# EAGLE design PCB (EAGLE 8.4.1)

## Sheet 1 of 2
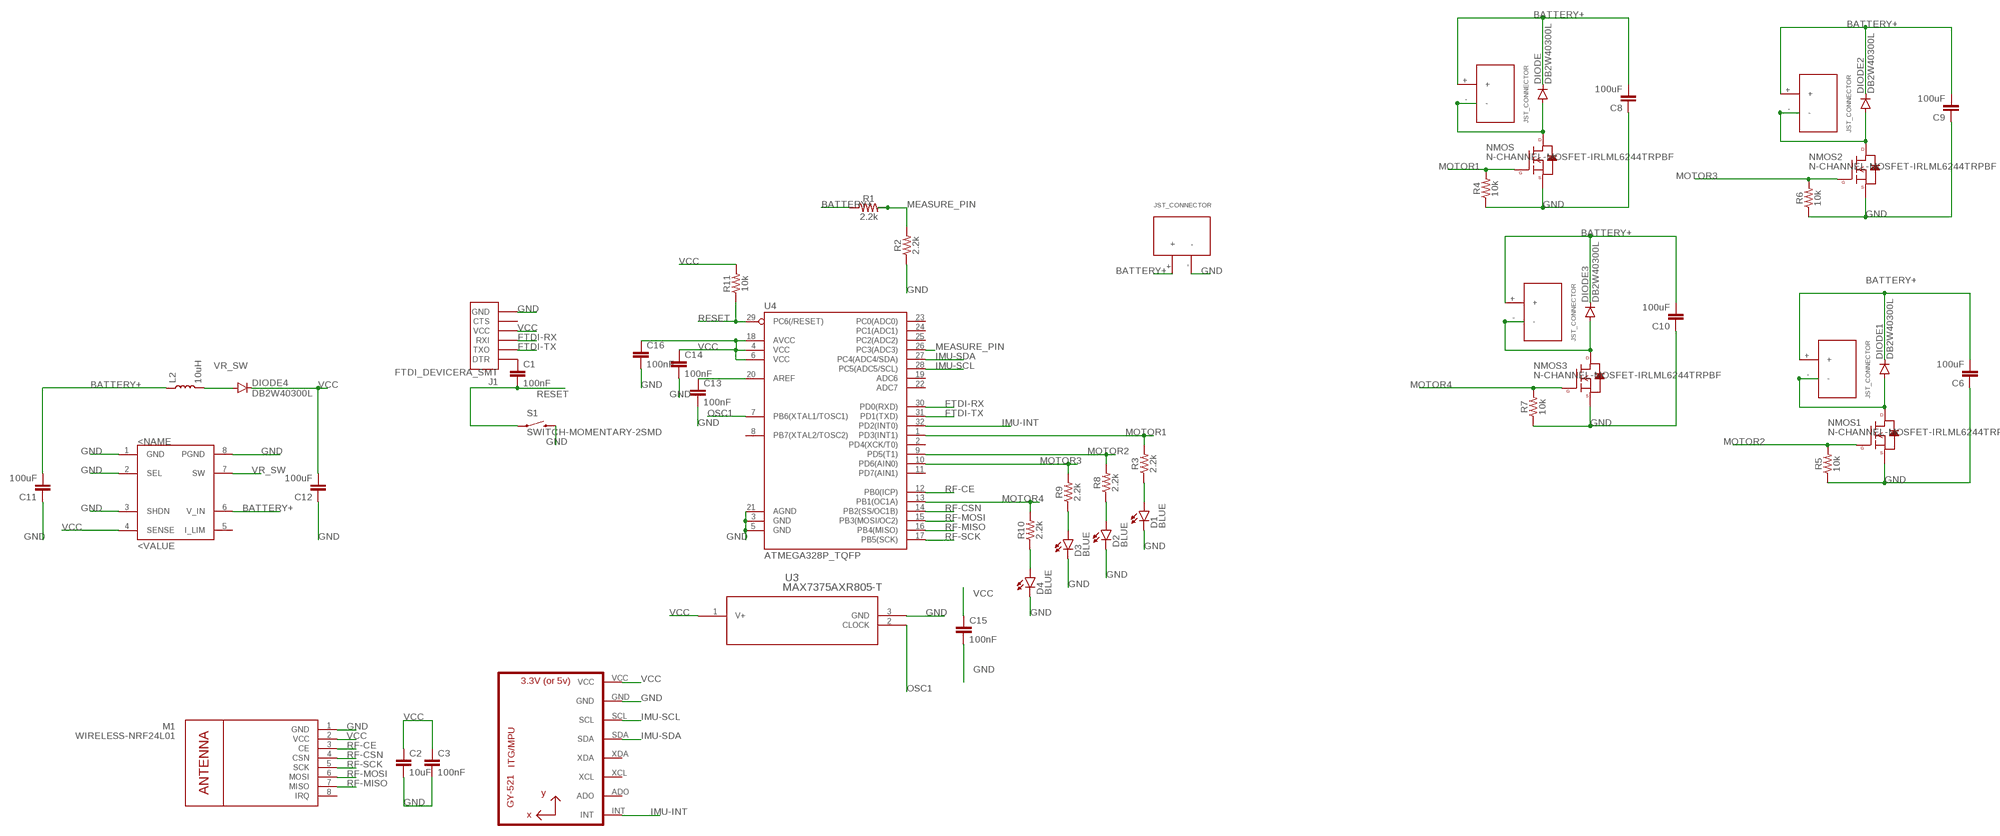
[diagram p0: schematic, sheet 1]

### Parts
BAT  JST_CONNECTOR_FEMALE  [JST_CONNECTOR_FEMALE]
C1  100nF  0.1UF-25V(+80/-20%)(0603)  [0603-CAP]
C2  10uF  CAP0603-CAP  [0603-CAP]
C3  100nF  CAP0603-CAP  [0603-CAP]
C6  100uF  CAP1206  [1206]
C8  100uF  CAP1206  [1206]
C9  100uF  CAP1206  [1206]
C10  100uF  CAP1206  [1206]
C11  100uF  CAP1206  [1206]
C12  100uF  CAP1206  [1206]
C13  100nF  CAP0603-CAP  [0603-CAP]
C14  100nF  CAP0603-CAP  [0603-CAP]
C15  100nF  0.1UF-25V(+80/-20%)(0603)  [0603-CAP]
C16  100nF  CAP0603-CAP  [0603-CAP]
D1  BLUE  LED-BLUE0603  [LED-0603]
D2  BLUE  LED-BLUE0603  [LED-0603]
D3  BLUE  LED-BLUE0603  [LED-0603]
D4  BLUE  LED-BLUE0603  [LED-0603]
DIODE  DB2W40300L  [MINI2-F3-B]
DIODE1  DB2W40300L  [MINI2-F3-B]
DIODE2  DB2W40300L  [MINI2-F3-B]
DIODE3  DB2W40300L  [MINI2-F3-B]
DIODE4  DB2W40300L  [MINI2-F3-B]
J1  FTDI_DEVICERA_SMT  [FTDI_DEVICE_RA_SMT]
L2  10uH  INDUCTOR-0603-33NH  [0603]
M1  WIRELESS-NRF24L01  [WIRELESS-NRF24L01]
MOTOR  JST_CONNECTOR_FEMALE  [JST_CONNECTOR_FEMALE]
MOTOR1  JST_CONNECTOR_FEMALE  [JST_CONNECTOR_FEMALE]
MOTOR2  JST_CONNECTOR_FEMALE  [JST_CONNECTOR_FEMALE]
MOTOR3  JST_CONNECTOR_FEMALE  [JST_CONNECTOR_FEMALE]
NMOS  N-CHANNEL-MOSFET-IRLML6244TRPBF  [SOT23-3]
NMOS1  N-CHANNEL-MOSFET-IRLML6244TRPBF  [SOT23-3]
NMOS2  N-CHANNEL-MOSFET-IRLML6244TRPBF  [SOT23-3]
NMOS3  N-CHANNEL-MOSFET-IRLML6244TRPBF  [SOT23-3]
R1  2.2k  2.2KOHM-0603-1/10W-1%  [0603]
R2  2.2k  2.2KOHM-0603-1/10W-1%  [0603]
R3  2.2k  2.2KOHM-0603-1/10W-1%  [0603]
R4  10k  2.2KOHM-0603-1/10W-1%  [0603]
R5  10k  2.2KOHM-0603-1/10W-1%  [0603]
R6  10k  2.2KOHM-0603-1/10W-1%  [0603]
R7  10k  2.2KOHM-0603-1/10W-1%  [0603]
R8  2.2k  2.2KOHM-0603-1/10W-1%  [0603]
R9  2.2k  2.2KOHM-0603-1/10W-1%  [0603]
R10  2.2k  2.2KOHM-0603-1/10W-1%  [0603]
R11  10k  2.2KOHM-0603-1/10W-1%  [0603]
S1  SWITCH-MOMENTARY-2SMD  [TACTILE-SWITCH-SMD]
U2  GY-521MPU6050  [GY-521]
U3  MAX7375AXR805-T  [21-0075D]
U4  ATMEGA328P_TQFP  [TQFP32-08]
U$4  LT1300CS8#PBF-NDLT1300CS8#PBF-ND  [SOIC-8_S]

### Nets
BATTERY+: BAT.+ C6.2 C8.2 C9.2 C10.2 C11.2 DIODE1.NEG(GPIN) DIODE2.NEG(GPIN) DIODE3.NEG(GPIN) DIODE.NEG(GPIN) L2.1 MOTOR1.+ MOTOR2.+ MOTOR3.+ MOTOR.+ R1.1 U$4.6(V_IN)
FTDI-RX: J1.3(RXI) U4.30(PD0(RXD))
FTDI-TX: J1.2(TXO) U4.31(PD1(TXD))
GND: BAT.- C2.2 C3.2 C6.1 C8.1 C9.1 C10.1 C11.1 C12.1 C13.2 C14.2 C15.2 C16.2 D1.C D2.C D3.C D4.C J1.6(GND) M1.1(GND) NMOS1.2(S) NMOS2.2(S) NMOS3.2(S) NMOS.2(S) R2.1 R4.1 R5.1 R6.1 R7.1 S1.3 U2.GND U3.3(GND) U4.3(GND) U4.5(GND) U4.21(AGND) U$4.1(GND) U$4.2(SEL) U$4.3(SHDN) U$4.8(PGND)
IMU-INT: U2.INT U4.32(PD2(INT0))
IMU-SCL: U2.SCL U4.28(PC5(ADC5/SCL))
IMU-SDA: U2.SDA U4.27(PC4(ADC4/SDA))
MEASURE_PIN: R1.2 R2.2 U4.26(PC3(ADC3))
MOTOR1: NMOS.1(G) R3.2 R4.2 U4.1(PD3(INT1))
MOTOR2: NMOS1.1(G) R5.2 R8.2 U4.9(PD5(T1))
MOTOR3: NMOS2.1(G) R6.2 R9.2 U4.10(PD6(AIN0))
MOTOR4: NMOS3.1(G) R7.2 R10.2 U4.13(PB1(OC1A))
N$1: D4.A R10.1
N$3: D3.A R9.1
N$4: DIODE1.POS(PPIN) MOTOR1.- NMOS1.3(D)
N$5: DIODE2.POS(PPIN) MOTOR2.- NMOS2.3(D)
N$6: DIODE.POS(PPIN) MOTOR.- NMOS.3(D)
N$7: DIODE3.POS(PPIN) MOTOR3.- NMOS3.3(D)
N$10: D2.A R8.1
N$11: D1.A R3.1
N$13: C1.1 J1.1(DTR)
N$15: C13.1 U4.20(AREF)
OSC1: U3.2(CLOCK) U4.7(PB6(XTAL1/TOSC1))
RESET: C1.2 R11.1 S1.1 U4.29(PC6(/RESET))
RF-CE: M1.3(CE) U4.12(PB0(ICP))
RF-CSN: M1.4(CSN) U4.14(PB2(SS/OC1B))
RF-MISO: M1.7(MISO) U4.16(PB4(MISO))
RF-MOSI: M1.6(MOSI) U4.15(PB3(MOSI/OC2))
RF-SCK: M1.5(SCK) U4.17(PB5(SCK))
VCC: C2.1 C3.1 C12.2 C14.1 C15.1 C16.1 DIODE4.NEG(GPIN) J1.4(VCC) M1.2(VCC) R11.2 U2.VCC U3.1(V+) U4.4(VCC) U4.6(VCC) U4.18(AVCC) U$4.4(SENSE)
VR_SW: DIODE4.POS(PPIN) L2.2 U$4.7(SW)
Unconnected: J1.5(CTS) M1.8(IRQ) U2.ADO U2.XCL U2.XDA U4.2(PD4(XCK/T0)) U4.8(PB7(XTAL2/TOSC2)) U4.11(PD7(AIN1)) U4.19(ADC6) U4.22(ADC7) U4.23(PC0(ADC0)) U4.24(PC1(ADC1)) U4.25(PC2(ADC2)) U$4.5(I_LIM)

## Sheet 2 of 2

## Library data of the parts
BAT MOTOR MOTOR1-MOTOR3 = quad:JST_CONNECTOR_FEMALE
C1 C15 = SparkFun-Capacitors:0.1UF-25V(+80/-20%)(0603): CAP-00810 Ceramic Standard decoupling cap; PROD_ID: CAP-00810; VALUE: 0.1uF
C2 C3 C6 C8-C14 C16 = SparkFun-Passives:CAP: Capacitor Standard 0603 ceramic capacitor, and 0.1" leaded capacitor.
D1 = LEDs:LED-BLUE: Blue LEDs for production use Various blue LEDs stocked by SparkFun production 0603 - DIO-08575 Rebel - DIO-09553 1206 - DIO-09911; PROD_ID: DIO-08575; SPICEPREFIX: D
D2-D4 = LEDs:LED-BLUE: Blue LEDs for production use Various blue LEDs stocked by SparkFun production 0603 - DIO-08575 Rebel - DIO-09553 1206 - DIO-09911; PROD_ID: DIO-08575
DIODE DIODE1-DIODE4 = quad:DB2W40300L
J1 = quad:FTDI_DEVICE: Connector which mates to FTDI basic or FTDI cable.; PROD_ID: CONN-08971
L2 = SparkFun-Coils:INDUCTOR: Inductors Resist changes in electrical current. Basically a coil of wire. SparkFun Products: SparkFun Load Cell Amplifier - HX711 <https://www.sparkfun.com/products/13879> IOIO-OTG - V2.2 <https://www.sparkfun.com/products/13613>; PROD_ID: NDUC-07874; VALUE: 33nH/±5%/500mA
M1 = quad:WIRELESS-NRF24L01: 2.4 GHz Wireless Module based on NRF24L01 chip
NMOS NMOS1-NMOS3 = quad:N-CHANNEL-MOSFET: N-Channel MOSFET Mode Field Effect Transistor; DATASHEET: http://www.mouser.com/ds/2/196/irlml6244pbf-936666.pdf; MOUSER: 942-IRLML6244TRPBF; URL: http://www.mouser.com/Search/ProductDetail.aspx?R=IRLML6244TRPBFvirtualkey57370000virtualkey942-IRLML6244TRPBF
R1 R2 R8-R10 = SparkFun-Resistors:2.2KOHM: 2.2kΩ resistor A resistor is a passive two-terminal electrical component that implements electrical resistance as a circuit element. Resistors act to reduce current flow, and, at the same time, act to lower voltage levels within circuits. - Wikipedia; PROD_ID: RES-08272
R3 = SparkFun-Resistors:2.2KOHM: 2.2kΩ resistor A resistor is a passive two-terminal electrical component that implements electrical resistance as a circuit element. Resistors act to reduce current flow, and, at the same time, act to lower voltage levels within circuits. - Wikipedia; PROD_ID: RES-08272; SPICEPREFIX: R
R4-R7 R11 = SparkFun-Resistors:2.2KOHM: 2.2kΩ resistor A resistor is a passive two-terminal electrical component that implements electrical resistance as a circuit element. Resistors act to reduce current flow, and, at the same time, act to lower voltage levels within circuits. - Wikipedia; PROD_ID: RES-08272; VALUE: 2.2k
S1 = quad:SWITCH-MOMENTARY-2: Various NO switches- pushbuttons, reed, etc; PROD_ID: SWCH-08247
U2 = quad:GY-521
U3 = MAX7375AXR805-T:MAX7375AXR805-T; AVAILABILITY: Good; DESCRIPTION: OSCILLATOR MEMS 8MHZ CMOS SMD; MF: Maxim Integrated; MP: MAX7375AXR805+T; PACKAGE: SC-70 Maxim Integrated; PRICE: 1.06 USD
U4 = quad:ATMEGA328P_TQFP; PROD_ID: IC-09069
U$4 = LT1300:LT1300CS8#PBF-ND

## Board
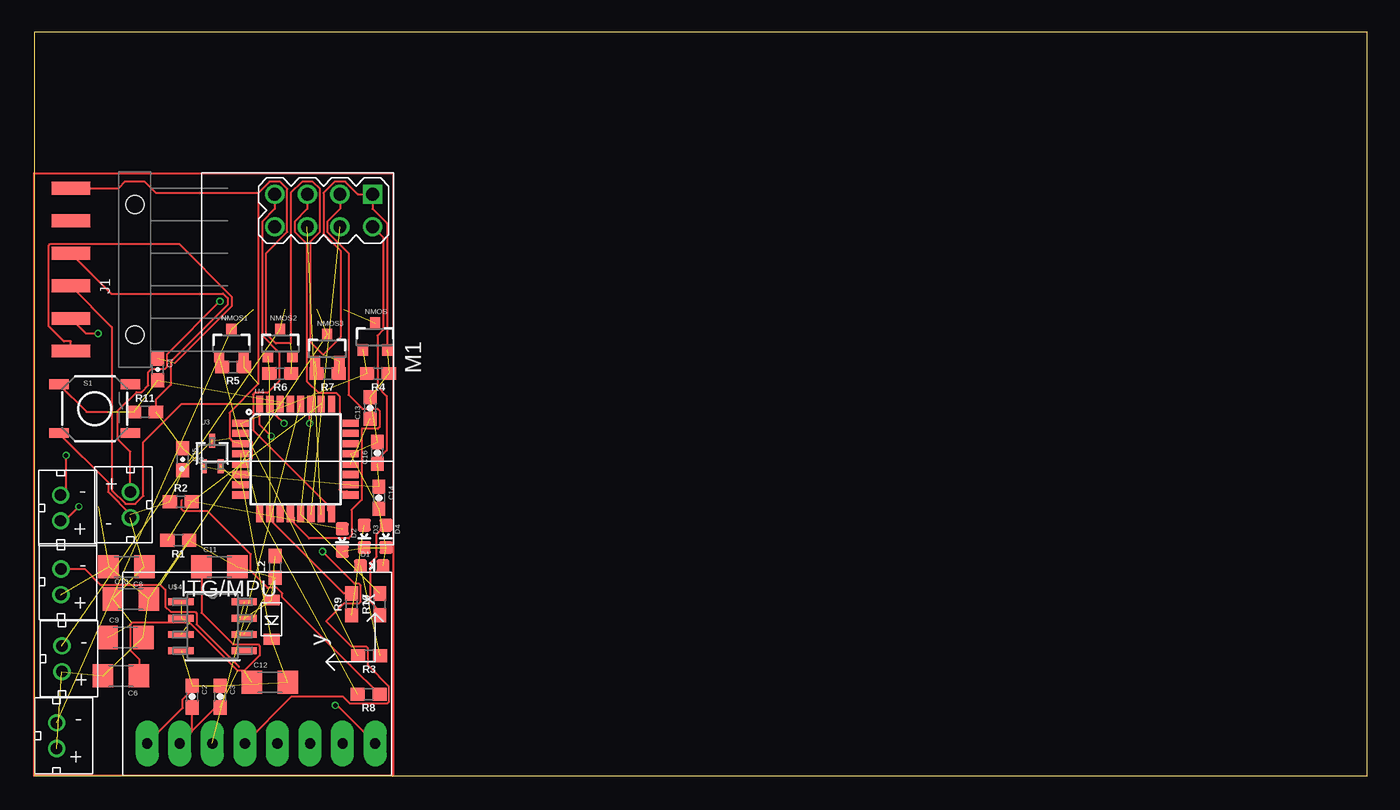
[diagram p1: board, top side]
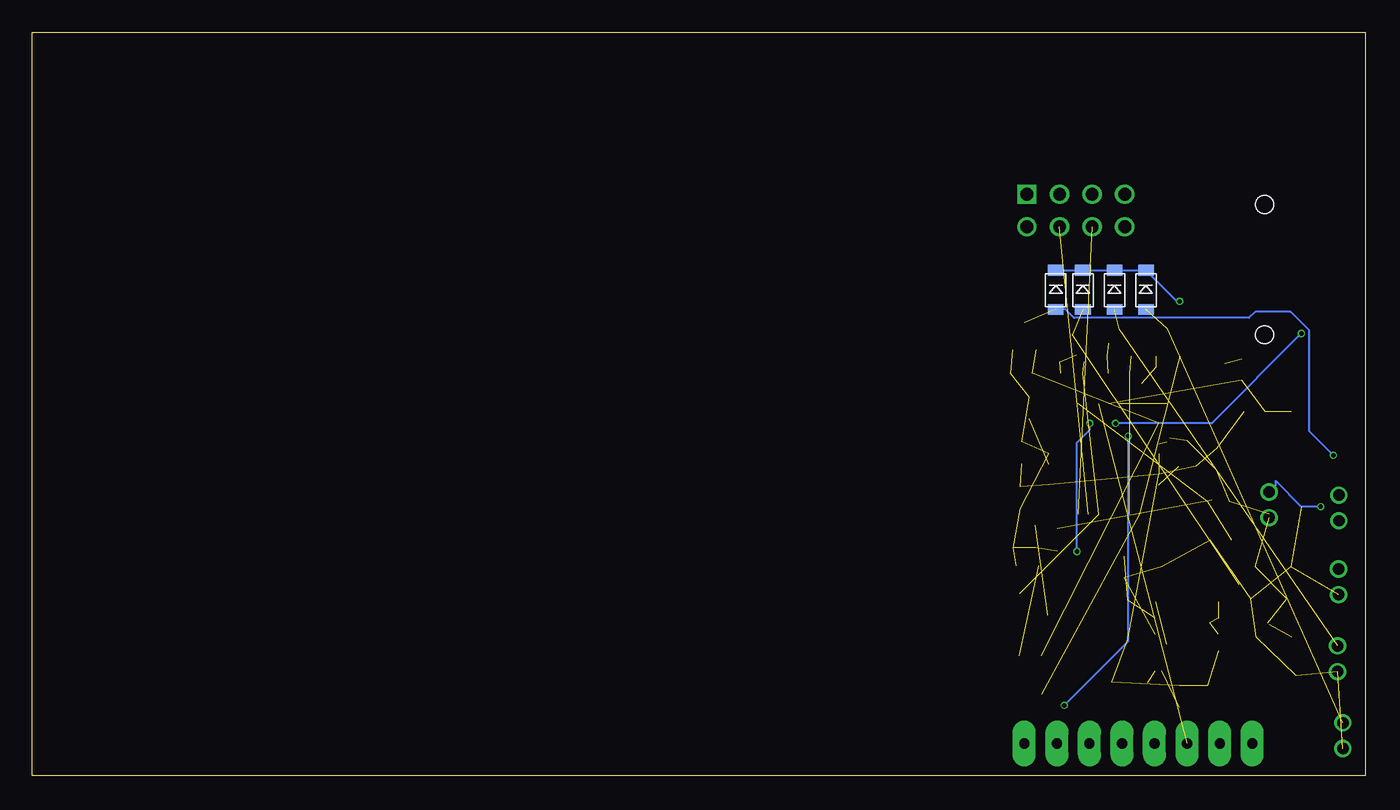
[diagram p2: board, bottom side, seen from below]

Size 104 x 58 mm. Coordinates in mm from the lower left corner, seen from the top.
Outline: 0,0 104,0 104,58 0,58 0,0
Copper layers (1*2*15*16): Top 0.035559375mm / dielectric 0.17018125mm / layer 2 0.01778125mm / dielectric 47mil / layer 15 0.01778125mm / dielectric 0.17018125mm / Bottom 0.035559375mm
Design rules "oshpark-4layer": minimum track width 5mil, minimum drill 10mil, track to track 5mil, track to pad 5mil, pad to pad 5mil, via to via 5mil, smd to smd 5mil, copper to edge 15mil, drill to drill 6mil, minimum pad ring 4mil, minimum via ring 4mil, stop-mask expansion 2.5mil, vias tented up to drill 0mil, thermal gap 10mil

### Footprints (pad centres in the part's own frame; a part is rotated, then mirrored left to right if it is on the bottom)
JST_CONNECTOR_FEMALE = drill 0.889: + 0,1; - 0,-1
0603-CAP = smd 1.1 x 1: 1 -0.85,0; 2 0.85,0
1206 = smd 1.6 x 1.8: 1 -1.4,0; 2 1.4,0
LED-0603 = smd 1 x 1: A 0,-0.877; C 0,0.877
MINI2-F3-B = smd 1.22 x 0.85: NEG 0,1.55; POS 0,-1.5
FTDI_DEVICE_RA_SMT = smd 1 x 3: 1 -6.35,5; 2 -3.81,5; 3 -1.27,5; 4 1.27,5; 5 3.81,5; 6 6.35,5 | hole 1.4: -5.08,0; 5.08,0
0603 = smd 1.1 x 1: 1 -0.85,0; 2 0.85,0
WIRELESS-NRF24L01 = drill 1 square: 1 -12.7,6.35 | drill 1: 2 -10.16,6.35; 3 -12.7,3.81; 4 -10.16,3.81; 5 -12.7,1.27; 6 -10.16,1.27; 7 -12.7,-1.27; 8 -10.16,-1.27
SOT23-3 = smd 0.8 x 0.9: 1 -0.95,-1; 2 0.95,-1; 3 0,1.1
TACTILE-SWITCH-SMD = smd 1.524 x 0.762: 1 -2.794,1.905; 2 2.794,1.905; 3 -2.794,-1.905; 4 2.794,-1.905
GY-521 = drill 0.8 pad 1.778 long: ADO -8.89,-6.35; GND -8.89,6.35; INT -8.89,-8.89; SCL -8.89,3.81; SDA -8.89,1.27; VCC -8.89,8.89; XCL -8.89,-3.81; XDA -8.89,-1.27
21-0075D = smd 0.457 x 1.118: 1 -0.65,-0.991; 2 0.65,-0.991; 3 0,0.991
TQFP32-08 = smd 1.27 x 0.559: 1 -4.293,2.8; 2 -4.293,2; 3 -4.293,1.2; 4 -4.293,0.4; 5 -4.293,-0.4; 6 -4.293,-1.2; 7 -4.293,-2; 8 -4.293,-2.8; 17 4.293,-2.8; 18 4.293,-2; 19 4.293,-1.2; 20 4.293,-0.4; 21 4.293,0.4; 22 4.293,1.2; 23 4.293,2; 24 4.293,2.8 | smd 0.559 x 1.27: 9 -2.8,-4.293; 10 -2,-4.293; 11 -1.2,-4.293; 12 -0.4,-4.293; 13 0.4,-4.293; 14 1.2,-4.293; 15 2,-4.293; 16 2.8,-4.293; 25 2.8,4.293; 26 2,4.293; 27 1.2,4.293; 28 0.4,4.293; 29 -0.4,4.293; 30 -1.2,4.293; 31 -2,4.293; 32 -2.8,4.293
SOIC-8_S = smd 1.981 x 0.533: 1 -2.464,1.905; 2 -2.464,0.635; 3 -2.464,-0.635; 4 -2.464,-1.905; 5 2.464,-1.905; 6 2.464,-0.635; 7 2.464,0.635; 8 2.464,1.905

### Placement (x,y rotation side)
BAT  7.52,21.14 0 top
C1  9.64,31.69 270 top
C2  12.33,6.19 270 top
C3  14.52,6.19 270 top
C6  6.79,7.8 180 top
C8  7.21,16.3 180 top
C9  7.13,10.8 0 top
C10  7.55,13.8 0 top
C11  14.47,16.3 0 top
C12  18.39,7.3 0 top
C13  26.21,28.69 90 top
C14  26.9,21.69 270 top
C15  11.59,24.69 270 top
C16  26.78,25.19 90 top
D1  26.35,16.38 270 top
D2  24.04,18.38 180 top
D3  25.76,18.69 180 top
D4  27.45,18.69 180 top
DIODE  24.16,37.87 0 bottom
DIODE1  17.12,37.87 0 bottom
DIODE2  19.58,37.87 0 bottom
DIODE3  22.04,37.87 0 bottom
DIODE4  18.53,12.22 180 top
J1  7.87,39.48 90 top
L2  18.81,16.3 90 top
M1  20.05,32.66 270 top
MOTOR  2.08,20.9 180 top
MOTOR1  1.76,3.14 180 top
MOTOR2  2.18,9.14 180 top
MOTOR3  2.1,15.14 180 top
NMOS  26.6,34.22 0 top
NMOS1  15.4,33.72 0 top
NMOS2  19.2,33.72 0 top
NMOS3  22.87,33.3 0 top
R1  11.26,18.38 180 top
R2  11.45,21.38 0 top
R3  26.14,9.38 180 top
R4  26.83,31.38 180 top
R5  15.52,31.88 180 top
R6  19.21,31.38 180 top
R7  22.9,31.38 180 top
R8  26.09,6.38 180 top
R9  24.78,13.38 90 top
R10  26.97,13.38 90 top
R11  8.66,28.38 0 top
S1  4.74,28.64 0 top
U2  17.72,11.43 90 top
U3  13.9,25.14 0 top
U4  20.4,24.71 0 top
U$4  13.93,11.67 0 top

### Tracks (layer width: path | path; a pad name or v marks a point on that pad's centre or on a via)
BATTERY+  (via drill 0.35)  (11 unrouted)
  Top 0.152: v14.5,37 10.37,32.87 10.37,31.89 10.23,31.76 9.19,31.76 8.91,31.48 8.91,30.46 8.39,29.93 7.99,29.93 6.54,28.49 6.54,26.26 7.52,25.28 BAT.+ | MOTOR.+ 2.4,19.9 v3.5,21
  Bottom 0.152: v14.5,37 14.7,37 16.85,39.15 | 16.85,39.15 DIODE1.NEG | DIODE1.NEG DIODE2.NEG DIODE3.NEG DIODE.NEG | DIODE1.NEG 16.85,39.15 | v3.5,21 5,21 7,23 7,22.66 BAT.+
FTDI-RX  (1 unrouted)
  Top 0.152: J1.3 6.08,35 6.08,22.27 7.14,21.21 7.9,21.21 8.53,21.83 8.53,26.02 11.51,29 15.5,29
FTDI-TX  (via drill 0.35)
  Top 0.152: J1.2 4.04,34.5 v5,34.5 | v19.5,27.5 18.86,28.14 18.83,28.14 18.4,28.57 U4.31
  Bottom 0.152: v5,34.5 12,27.5 v19.5,27.5
GND  (30 unrouted)
  Top 0.152: U4.5 16.4,24.6 16.84,24.6 16.97,24.74 16.97,26.08 15.5,26.08 15.24,26.34 15.24,28.32 17.49,30.56 17.49,45.46 17.52,45.48 | 17.52,45.48 18.37,46.34 19.19,46.34 19.76,45.77 19.76,42.41 18.1,40.75 18.1,34.47 18.85,33.72 20.03,33.72 20.03,45.46 20.91,46.34 21.73,46.34 22.3,45.77 22.3,42.41 21.58,41.69 21.58,33.82 22.55,32.84 23.91,34.2 23.91,40.95 22.57,42.29 22.57,45.46 23.45,46.34 24.27,46.34 25.25,45.36 M1.1 26.4,44.21 27.53,43.08 27.53,33.24 NMOS.2 | 17.52,45.48 9.48,45.48 8.61,46.35 7.13,46.35 6.61,45.83 J1.6 | S1.3 5.77,22.91 5.77,22.14 7.52,20.4 BAT.- | C2.2 12.33,3.5 U2.GND 14.17,5.34 C3.2 | C6.1 8.19,9.12 7.5,9.8 7.5,11.79 7.63,11.93 12.14,11.93 15.87,8.2 16.41,8.2 17.61,9.4 17.61,10.13 17.48,10.26 15.52,10.26 13.07,12.71 C11.1
IMU-INT  (via drill 0.35)
  Top 0.152: U2.INT 23.65,5.5 v23.5,5.5 | v18.5,26.5 17.6,27.4 U4.32
  Bottom 0.152: v23.5,5.5 18.5,10.5 v18.5,26.5
IMU-SCL  (1 unrouted)
IMU-SDA  (via drill 0.35)
  Top 0.152: 16.5,2 16.45,2.05 U2.SDA 20.11,6.2 24.09,6.2 24.61,5.68 27.57,5.68 27.69,5.8 27.69,6.96 26.04,8.61 26.04,9.96 25.92,10.08 24.79,10.08 22.8,12.08 24.2,13.48 25.36,13.48 25.48,13.6 25.48,14.86 25.36,14.98 25.02,14.98 v22.5,17.5 | v21.5,27.5 21.5,28.9 U4.27
  Bottom 0.152: v22.5,17.5 22.5,26 21.5,27 v21.5,27.5
MEASURE_PIN  (2 unrouted)
MOTOR1  (3 unrouted)
MOTOR2  (3 unrouted)
MOTOR3  (2 unrouted)
  Top 0.152: U4.10 18.69,20.12 18.69,19.69 24.15,14.23 R9.2
MOTOR4  (3 unrouted)
N$1
  Top 0.152: R10.1 26.97,12.86 26.24,13.59 26.24,16.63 26.72,17.11 26.72,18.84 D4.A
N$2  (via drill 0.35)
  other vias: -22,44
N$3  (1 unrouted)
N$4  (2 unrouted)
N$5  (2 unrouted)
N$6  (via drill 0.35)  (1 unrouted)
  Top 0.152: MOTOR.- 2.5,22.32 v2.5,25
  Bottom 0.152: DIODE.POS 23.4,36.37 22.75,35.72 9.09,35.72 8.61,36.19 5.83,36.19 4.39,34.75 4.39,26.89 v2.5,25
N$7  (2 unrouted)
  Top 0.152: MOTOR3.- 3.95,16.14 5.16,14.93 9.85,14.93 10.25,14.53 10.25,13.21 10.66,12.8 12.55,12.8 12.69,12.67 12.69,11.81 16,8.5
N$8
  Top 0.152: 0,47 28,47 28,0 0,0 0,47
N$10  (1 unrouted)
  Top 0.152: R8.1 24.67,8.65 24.64,8.65 19.37,13.93 19.37,14.24 18.94,14.67 18.21,14.67 16.9,15.99 16.9,17.3 13.54,20.65 11.65,20.65 11.52,20.79 11.52,21.5
N$11  (1 unrouted)
N$13  (1 unrouted)
  Top 0.152: 10.98,32.19 15.41,36.62 15.41,37.38 11.31,41.48 1.27,41.48 1.14,41.34 1.14,35.08 2.32,33.89 2.87,33.89 J1.1
N$15  (1 unrouted)
OSC1  (1 unrouted)
RESET  (3 unrouted)
  Top 0.152: S1.1 4.11,28.38 5.77,28.38
RF-CE
  Top 0.152: M1.3 23.86,44.21 22.88,43.23 22.88,42.41 24.53,40.76 24.53,29.7 25.61,28.62 26.8,28.62 26.94,28.48 26.94,27.2 26.8,27.06 25.56,27.06 25.56,21.54 24.77,20.75 24.77,18.75 24.55,18.53 21.45,18.53 20.29,19.69 20.29,20.12 U4.12
RF-CSN  (1 unrouted)
RF-MISO
  Top 0.152: U4.16 22.91,20.71 22.91,21.15 17.09,26.96 17.09,29.73 17.23,29.87 18.22,29.87 19.14,30.79 19.14,33.01 17.8,34.35 17.8,43.23 18.78,44.21 M1.7
RF-MOSI  (1 unrouted)
RF-SCK
  Top 0.152: U4.17 24.4,22.2 23.96,22.2 23.83,22.34 23.83,29.61 23.57,29.87 22.19,29.87 21.27,30.79 21.27,41.48 20.34,42.41 20.34,43.23 21.32,44.21 M1.5
VCC  (12 unrouted)
  Top 0.152: C16.1 26.78,24.67 27.51,25.39 27.51,29.61 26.78,30.34 26.78,34.33 27.23,34.77 27.23,41.99 M1.2 | R11.2 9.51,29.34 10.67,30.5 10.67,32.31 15.11,36.75 15.11,37.25 14.75,37.61 6.01,37.61 J1.4 | U2.VCC 11.6,5.31 11.6,5.99 12.33,6.71 C2.1
VR_SW  (2 unrouted)